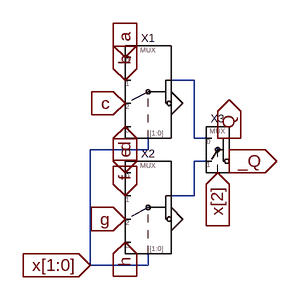
[diagram p0: schematic mux-1bit-8to1.asc]
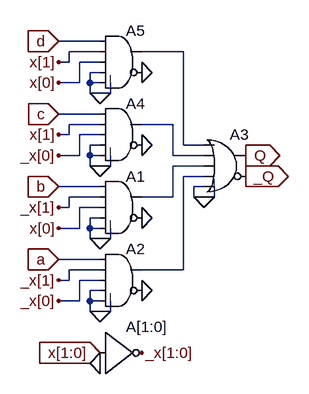
[diagram p1: sub-circuit mux-1bit-4to1.asc]
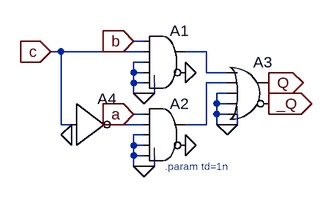
[diagram p2: sub-circuit mux-1bit-2to1.asc]
mux-1bit-8to1.asc, the LTspice schematic file:
Version 4
SHEET 1 880 680
WIRE 240 0 208 0
WIRE 240 80 240 0
WIRE 256 80 240 80
WIRE 176 96 176 80
WIRE 176 96 96 96
WIRE 256 112 240 112
WIRE 240 160 240 112
WIRE 240 160 208 160
WIRE 96 256 96 96
WIRE 176 256 176 240
WIRE 176 256 96 256
FLAG 144 0 b
IOPIN 144 0 In
FLAG 96 256 x[1:0]
IOPIN 96 256 In
FLAG 144 -32 a
IOPIN 144 -32 In
FLAG 288 112 _Q
IOPIN 288 112 Out
FLAG 288 80 Q
IOPIN 288 80 Out
FLAG 144 32 c
IOPIN 144 32 In
FLAG 144 64 d
IOPIN 144 64 In
FLAG 144 160 f
IOPIN 144 160 In
FLAG 144 128 e
IOPIN 144 128 In
FLAG 144 192 g
IOPIN 144 192 In
FLAG 144 224 h
IOPIN 144 224 In
FLAG 272 128 x[2]
IOPIN 272 128 In
FLAG 208 192 0
FLAG 208 32 0
SYMBOL mux-1bit-4to1 176 16 R0
SYMATTR InstName X1
SYMBOL mux-1bit-4to1 176 176 R0
SYMATTR InstName X2
SYMBOL mux-1bit-2to1 272 96 R0
SYMATTR InstName X3

mux-1bit-4to1.asc, the sub-circuit schematic file:
Version 4
SHEET 1 880 680
WIRE 144 -160 80 -160
WIRE 144 -144 96 -144
WIRE 272 -144 208 -144
WIRE 96 -128 96 -144
WIRE 96 -128 80 -128
WIRE 144 -128 112 -128
WIRE 144 -112 128 -112
WIRE 112 -96 112 -128
WIRE 112 -96 80 -96
WIRE 128 -96 128 -112
WIRE 144 -96 128 -96
WIRE 128 -80 128 -96
WIRE 144 -80 128 -80
WIRE 160 -80 160 -96
WIRE 160 -80 144 -80
WIRE 144 -48 80 -48
WIRE 144 -32 96 -32
WIRE 256 -32 208 -32
WIRE 96 -16 96 -32
WIRE 96 -16 80 -16
WIRE 144 -16 112 -16
WIRE 144 0 128 0
WIRE 272 0 272 -144
WIRE 304 0 272 0
WIRE 112 16 112 -16
WIRE 112 16 80 16
WIRE 128 16 128 0
WIRE 144 16 128 16
WIRE 256 16 256 -32
WIRE 304 16 256 16
WIRE 128 32 128 16
WIRE 144 32 128 32
WIRE 160 32 160 16
WIRE 160 32 144 32
WIRE 304 32 256 32
WIRE 304 48 272 48
WIRE 144 64 80 64
WIRE 304 64 288 64
WIRE 144 80 96 80
WIRE 256 80 256 32
WIRE 256 80 208 80
WIRE 288 80 288 64
WIRE 304 80 288 80
WIRE 320 80 320 64
WIRE 320 80 304 80
WIRE 96 96 96 80
WIRE 96 96 80 96
WIRE 144 96 112 96
WIRE 144 112 128 112
WIRE 112 128 112 96
WIRE 112 128 80 128
WIRE 128 128 128 112
WIRE 144 128 128 128
WIRE 128 144 128 128
WIRE 144 144 128 144
WIRE 160 144 160 128
WIRE 160 144 144 144
WIRE 144 176 80 176
WIRE 144 192 96 192
WIRE 272 192 272 48
WIRE 272 192 208 192
WIRE 96 208 96 192
WIRE 96 208 80 208
WIRE 144 208 112 208
WIRE 144 224 128 224
WIRE 112 240 112 208
WIRE 112 240 80 240
WIRE 128 240 128 224
WIRE 144 240 128 240
WIRE 128 256 128 240
WIRE 144 256 128 256
WIRE 160 256 160 240
WIRE 160 256 144 256
FLAG 144 144 0
FLAG 208 112 0
FLAG 80 64 b
IOPIN 80 64 In
FLAG 144 320 x[1:0]
IOPIN 144 320 In
FLAG 144 256 0
FLAG 208 224 0
FLAG 80 176 a
IOPIN 80 176 In
FLAG 304 80 0
FLAG 368 48 _Q
IOPIN 368 48 Out
FLAG 368 16 Q
IOPIN 368 16 Out
FLAG 144 336 0
FLAG 208 320 _x[1:0]
FLAG 80 208 _x[1]
FLAG 80 240 _x[0]
FLAG 80 96 _x[1]
FLAG 80 128 x[0]
FLAG 144 32 0
FLAG 208 0 0
FLAG 80 -48 c
IOPIN 80 -48 In
FLAG 80 -16 x[1]
FLAG 80 16 _x[0]
FLAG 144 -80 0
FLAG 208 -112 0
FLAG 80 -160 d
IOPIN 80 -160 In
FLAG 80 -128 x[1]
FLAG 80 -96 x[0]
SYMBOL Digital\\and 176 32 R0
SYMATTR InstName A1
SYMBOL Digital\\or 336 -32 R0
SYMATTR InstName A3
SYMBOL Digital\\inv 144 256 R0
SYMATTR InstName A[1:0]
SYMBOL Digital\\and 176 144 R0
SYMATTR InstName A2
SYMBOL Digital\\and 176 -80 R0
SYMATTR InstName A4
SYMBOL Digital\\and 176 -192 R0
SYMATTR InstName A5

mux-1bit-2to1.asc, the sub-circuit schematic file:
Version 4
SHEET 1 880 680
WIRE 144 64 128 64
WIRE 16 80 0 80
WIRE 144 80 16 80
WIRE 240 80 208 80
WIRE 144 96 128 96
WIRE 128 112 128 96
WIRE 144 112 128 112
WIRE 240 112 240 80
WIRE 272 112 240 112
WIRE 128 128 128 112
WIRE 144 128 128 128
WIRE 272 128 240 128
WIRE 128 144 128 128
WIRE 144 144 128 144
WIRE 160 144 160 128
WIRE 160 144 144 144
WIRE 272 144 256 144
WIRE 256 160 256 144
WIRE 272 160 256 160
WIRE 144 176 128 176
WIRE 256 176 256 160
WIRE 272 176 256 176
WIRE 16 192 16 80
WIRE 32 192 16 192
WIRE 144 192 96 192
WIRE 240 192 240 128
WIRE 240 192 208 192
WIRE 256 192 256 176
WIRE 272 192 256 192
WIRE 288 192 288 176
WIRE 288 192 272 192
WIRE 144 208 128 208
WIRE 128 224 128 208
WIRE 144 224 128 224
WIRE 128 240 128 224
WIRE 144 240 128 240
WIRE 128 256 128 240
WIRE 144 256 128 256
WIRE 160 256 160 240
WIRE 160 256 144 256
FLAG 144 144 0
FLAG 208 112 0
FLAG 128 64 b
IOPIN 128 64 In
FLAG 0 80 c
IOPIN 0 80 In
FLAG 144 256 0
FLAG 208 224 0
FLAG 128 176 a
IOPIN 128 176 In
FLAG 272 192 0
FLAG 336 160 _Q
IOPIN 336 160 Out
FLAG 336 128 Q
IOPIN 336 128 Out
FLAG 32 208 0
SYMBOL Digital\\and 176 32 R0
SYMATTR InstName A1
SYMBOL Digital\\or 304 80 R0
SYMATTR InstName A3
SYMBOL Digital\\inv 32 128 R0
SYMATTR InstName A4
SYMBOL Digital\\and 176 144 R0
SYMATTR InstName A2
TEXT 176 256 Left 1 ;.param td=1n

The netlist it stands for:
* mux-1bit-8to1.asc
XX1 a d x[1] x[0] 0 N001 c b mux-1bit-4to1
XX2 e h x[1] x[0] 0 N002 g f mux-1bit-4to1
XX3 N001 N002 x[2] _Q Q mux-1bit-2to1

* block symbol definitions
.subckt mux-1bit-4to1 a d x[1] x[0] _Q Q c b
A1 b _x[1] x[0] 0 0 0 N003 0 AND
A3 N001 N002 N003 N004 0 _Q Q 0 OR
A[1:0] x[1:0] 0 0 0 0 _x[1:0] 0 0 BUF
A2 a _x[1] _x[0] 0 0 0 N004 0 AND
A4 c x[1] _x[0] 0 0 0 N002 0 AND
A5 d x[1] x[0] 0 0 0 N001 0 AND
.ends mux-1bit-4to1

.subckt mux-1bit-2to1 a b c _Q Q
A1 b c 0 0 0 0 N001 0 AND
A3 N001 N002 0 0 0 _Q Q 0 OR
A4 c 0 0 0 0 N003 0 0 BUF
A2 a N003 0 0 0 0 N002 0 AND
* .param td=1n
.ends mux-1bit-2to1

.backanno
.end